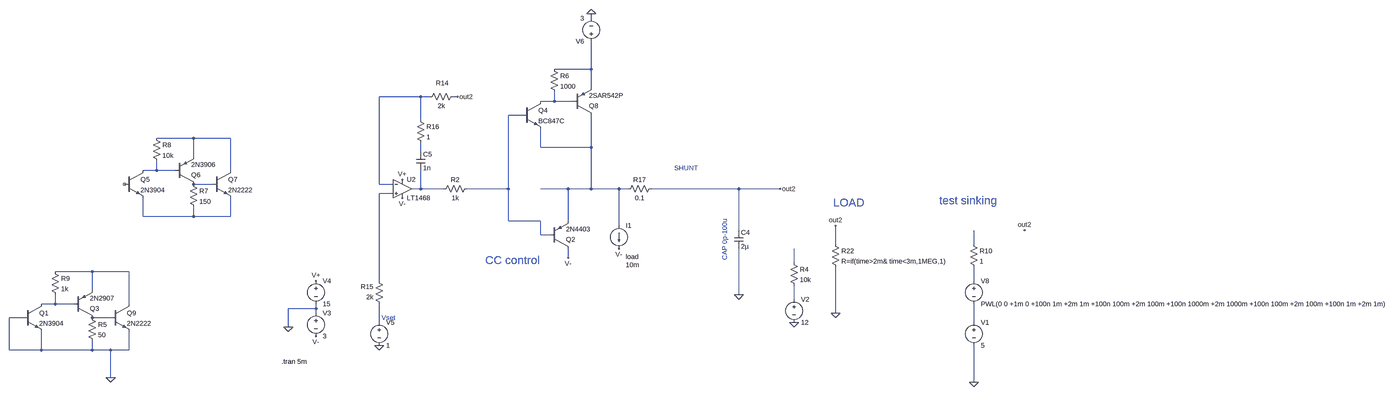
[diagram p0: schematic super_fast_push_pull_enhanced_sziklai.asc, whole sheet]
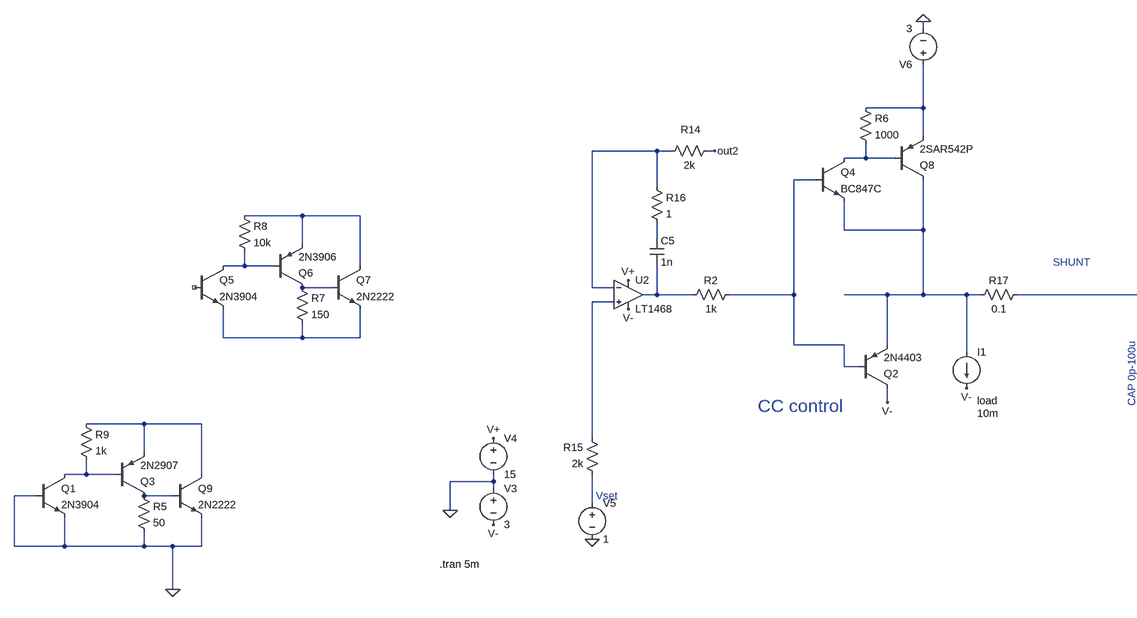
[diagram p1: schematic super_fast_push_pull_enhanced_sziklai.asc, part, row 1 of 1, column 1 of 2]
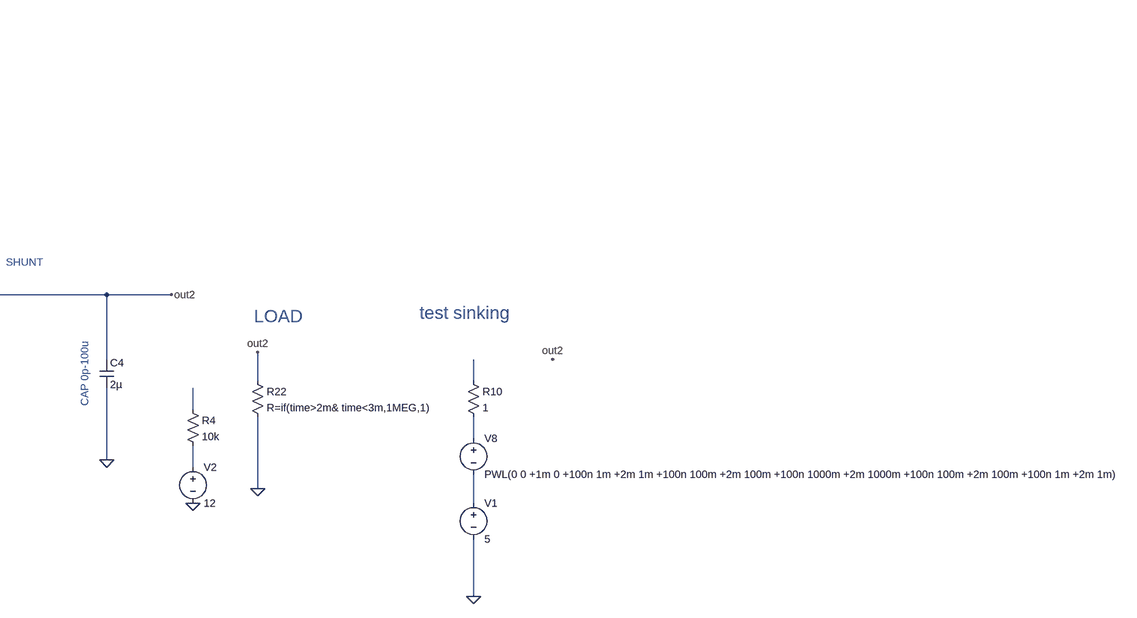
[diagram p2: schematic super_fast_push_pull_enhanced_sziklai.asc, part, row 1 of 1, column 2 of 2]
super_fast_push_pull_enhanced_sziklai.asc, the LTspice schematic file:
Version 4
SHEET 1 8456 1444
WIRE 352 -448 352 -464
WIRE 352 -272 352 -368
WIRE 352 -272 224 -272
WIRE 352 -208 352 -272
WIRE -240 -176 -384 -176
WIRE -208 -176 -240 -176
WIRE -112 -176 -128 -176
WIRE 224 -160 224 -192
WIRE 224 -160 176 -160
WIRE 288 -160 224 -160
WIRE 112 -112 64 -112
WIRE -240 -96 -240 -176
WIRE -1280 -32 -1408 -32
WIRE -1152 -32 -1280 -32
WIRE 176 0 176 -64
WIRE 352 0 352 -112
WIRE 352 0 176 0
WIRE -240 16 -240 -16
WIRE -1280 32 -1280 -32
WIRE -1408 80 -1408 48
WIRE -1408 80 -1456 80
WIRE -1344 80 -1408 80
WIRE -1152 80 -1152 -32
WIRE -1216 128 -1280 128
WIRE -384 128 -384 -176
WIRE -336 128 -384 128
WIRE -240 144 -240 80
WIRE -240 144 -272 144
WIRE -160 144 -240 144
WIRE 64 144 64 -112
WIRE 64 144 -80 144
WIRE 272 144 176 144
WIRE 352 144 352 0
WIRE 352 144 272 144
WIRE 448 144 352 144
WIRE 480 144 448 144
WIRE 864 144 560 144
WIRE 1008 144 864 144
WIRE -336 160 -384 160
WIRE -1456 240 -1456 176
WIRE -1280 240 -1280 208
WIRE -1280 240 -1456 240
WIRE -1152 240 -1152 176
WIRE -1152 240 -1280 240
WIRE 64 256 64 144
WIRE 176 256 64 256
WIRE 272 256 272 144
WIRE 448 272 448 144
WIRE 864 288 864 144
WIRE 176 304 176 256
WIRE 208 304 176 304
WIRE 1200 336 1200 272
WIRE 1680 336 1680 288
WIRE 272 384 272 352
WIRE 1056 400 1056 352
WIRE -1632 432 -1760 432
WIRE -1504 432 -1632 432
WIRE -384 464 -384 160
WIRE 1680 464 1680 416
WIRE -1632 496 -1632 432
WIRE 864 512 864 352
WIRE 1056 528 1056 480
WIRE -1760 544 -1760 512
WIRE -1760 544 -1808 544
WIRE -1696 544 -1760 544
WIRE -1504 544 -1504 432
WIRE -752 560 -752 544
WIRE -752 560 -848 560
WIRE -752 576 -752 560
WIRE 1200 576 1200 416
WIRE -1872 592 -1920 592
WIRE -1568 592 -1632 592
WIRE -384 608 -384 544
WIRE 1680 608 1680 544
WIRE -848 624 -848 560
WIRE -1920 704 -1920 592
WIRE -1808 704 -1808 640
WIRE -1808 704 -1920 704
WIRE -1632 704 -1632 672
WIRE -1632 704 -1808 704
WIRE -1568 704 -1632 704
WIRE -1504 704 -1504 640
WIRE -1504 704 -1568 704
WIRE -1568 800 -1568 704
WIRE 1680 816 1680 688
FLAG -848 624 0
FLAG -752 464 V+
FLAG -752 656 V-
FLAG -304 112 V+
FLAG -304 176 V-
FLAG 1008 144 out2
FLAG 1200 576 0
FLAG 864 512 0
FLAG 1680 816 0
FLAG 1856 288 out2
FLAG -384 688 0
FLAG 1200 272 out2
FLAG 448 352 V-
FLAG 1056 608 0
FLAG -112 -176 out2
FLAG 272 384 V-
FLAG -1568 800 0
FLAG 352 -464 0
SYMBOL voltage -752 560 R0
WINDOW 123 0 0 Left 0
WINDOW 39 0 0 Left 0
SYMATTR InstName V3
SYMATTR Value 3
SYMBOL voltage -752 448 R0
WINDOW 123 0 0 Left 0
WINDOW 39 0 0 Left 0
SYMATTR InstName V4
SYMATTR Value 15
SYMBOL cap -256 16 R0
SYMATTR InstName C5
SYMATTR Value 1n
SYMBOL res -112 -192 R90
WINDOW 0 -16 53 VBottom 2
WINDOW 3 32 56 VTop 2
SYMATTR InstName R14
SYMATTR Value 2k
SYMBOL res -368 560 R180
WINDOW 0 36 76 Left 2
WINDOW 3 36 40 Left 2
SYMATTR InstName R15
SYMATTR Value 2k
SYMBOL res 464 160 R270
WINDOW 0 32 56 VTop 2
WINDOW 3 0 56 VBottom 2
SYMATTR InstName R17
SYMATTR Value 0.1
SYMBOL res 1184 320 R0
SYMATTR InstName R22
SYMATTR Value R=if(time>2m& time<3m,1MEG,1)
SYMBOL cap 848 288 R0
SYMATTR InstName C4
SYMATTR Value 2µ
SYMATTR SpiceLine Rser=0.5
SYMBOL voltage 1680 448 R0
WINDOW 123 0 0 Left 0
WINDOW 39 0 0 Left 0
SYMATTR InstName V8
SYMATTR Value PWL(0 0 +1m 0 +100n 1m +2m 1m +100n 100m +2m 100m +100n 1000m +2m 1000m +100n 100m +2m 100m +100n 1m +2m 1m)
SYMBOL res 1664 320 R0
SYMATTR InstName R10
SYMATTR Value 1
SYMBOL voltage -384 592 R0
WINDOW 123 0 0 Left 0
WINDOW 39 0 0 Left 0
SYMATTR InstName V5
SYMATTR Value 1
SYMBOL OpAmps\\LT1468 -304 80 R0
SYMATTR InstName U2
SYMBOL voltage 1680 592 R0
WINDOW 123 0 0 Left 0
WINDOW 39 0 0 Left 0
SYMATTR InstName V1
SYMATTR Value 5
SYMBOL current 448 272 R0
WINDOW 3 24 136 Left 2
WINDOW 123 0 0 Left 0
WINDOW 39 24 108 Left 2
SYMATTR Value 10m
SYMATTR SpiceLine load
SYMATTR InstName I1
SYMBOL voltage 1056 512 R0
WINDOW 123 0 0 Left 0
WINDOW 39 0 0 Left 0
SYMATTR InstName V2
SYMATTR Value 12
SYMBOL res 1040 384 R0
SYMATTR InstName R4
SYMATTR Value 10k
SYMBOL npn -1520 80 R0
SYMATTR InstName Q5
SYMATTR Value 2N3904
SYMBOL pnp -1344 128 M180
SYMATTR InstName Q6
SYMATTR Value 2N3906
SYMBOL res -1296 112 R0
SYMATTR InstName R7
SYMATTR Value 150
SYMBOL npn -1216 80 R0
SYMATTR InstName Q7
SYMATTR Value 2N2222
SYMBOL res -1424 -48 R0
SYMATTR InstName R8
SYMATTR Value 10k
SYMBOL npn 112 -160 R0
SYMATTR InstName Q4
SYMATTR Value BC847C
SYMBOL pnp 288 -112 M180
SYMATTR InstName Q8
SYMATTR Value 2SAR542P
SYMBOL res 208 -288 R0
SYMATTR InstName R6
SYMATTR Value 1000
SYMBOL npn -1872 544 R0
SYMATTR InstName Q1
SYMATTR Value 2N3904
SYMBOL pnp -1696 592 M180
SYMATTR InstName Q3
SYMATTR Value 2N2907
SYMBOL res -1648 576 R0
SYMATTR InstName R5
SYMATTR Value 50
SYMBOL npn -1568 544 R0
SYMATTR InstName Q9
SYMATTR Value 2N2222
SYMBOL res -1776 416 R0
SYMATTR InstName R9
SYMATTR Value 1k
SYMBOL res -64 128 R90
WINDOW 0 0 56 VBottom 2
WINDOW 3 32 56 VTop 2
SYMATTR InstName R2
SYMATTR Value 1k
SYMBOL res -256 -112 R0
SYMATTR InstName R16
SYMATTR Value 1
SYMBOL voltage 352 -352 R180
WINDOW 123 0 0 Left 0
WINDOW 39 0 0 Left 0
SYMATTR InstName V6
SYMATTR Value 3
SYMBOL pnp 208 352 M180
SYMATTR InstName Q2
SYMATTR Value 2N4403
TEXT -872 744 Left 2 !.tran 5m
TEXT -376 592 Left 2 ;Vset
TEXT 640 72 Left 2 ;SHUNT
TEXT 1192 192 Left 4 ;LOAD
TEXT 816 392 VLeft 2 ;CAP 0p-100u
TEXT -16 392 Left 4 ;CC control
TEXT 1560 184 Left 4 ;test sinking

The netlist it stands for:
* super_fast_push_pull_enhanced_sziklai.asc
V3 0 V- 3
V4 V+ 0 15
C5 N007 N010 1n
R14 out2 N002 2k
R15 N020 N011 2k
R17 N006 out2 0.1
R22 out2 0 R=if(time>2m& time<3m,1MEG,1)
C4 out2 0 2µ Rser=0.5
V8 N016 N021 PWL(0 0 +1m 0 +100n 1m +2m 1m +100n 100m +2m 100m +100n 1000m +2m 1000m +100n 100m +2m 100m +100n 1m +2m 1m)
R10 N013 N016 1
V5 N020 0 1
XU2 N011 N002 V+ V- N010 LT1468  ; pins In+ In- V+ V- OUT
V1 N021 0 5
I1 N006 V- 10m load
V2 N017 0 12
R4 N014 N017 10k
Q5 N008 NC_01 N012 0 2N3904
Q6 N009 N008 N005 0 2N3906
R7 N009 N012 150
Q7 N005 N009 N012 0 2N2222
R8 N005 N008 10k
Q4 N003 N004 N006 0 BC847C
Q8 N006 N003 N001 0 2SAR542P
R6 N001 N003 1000
Q1 N018 0 0 0 2N3904
Q3 N019 N018 N015 0 2N2907
R5 N019 0 50
Q9 N015 N019 0 0 2N2222
R9 N015 N018 1k
R2 N004 N010 1k
R16 N002 N007 1
V6 N001 0 3
Q2 V- N004 N006 0 2N4403
.model NPN NPN
.model PNP PNP
.lib standard.bjt
.tran 5m
* Vset
* SHUNT
* LOAD
* CAP 0p-100u
* CC control
* test sinking
.backanno
.end